# EAGLE schematic ManniRaspiRadio (EAGLE 7.3.0)

## Sheet 1 of 2
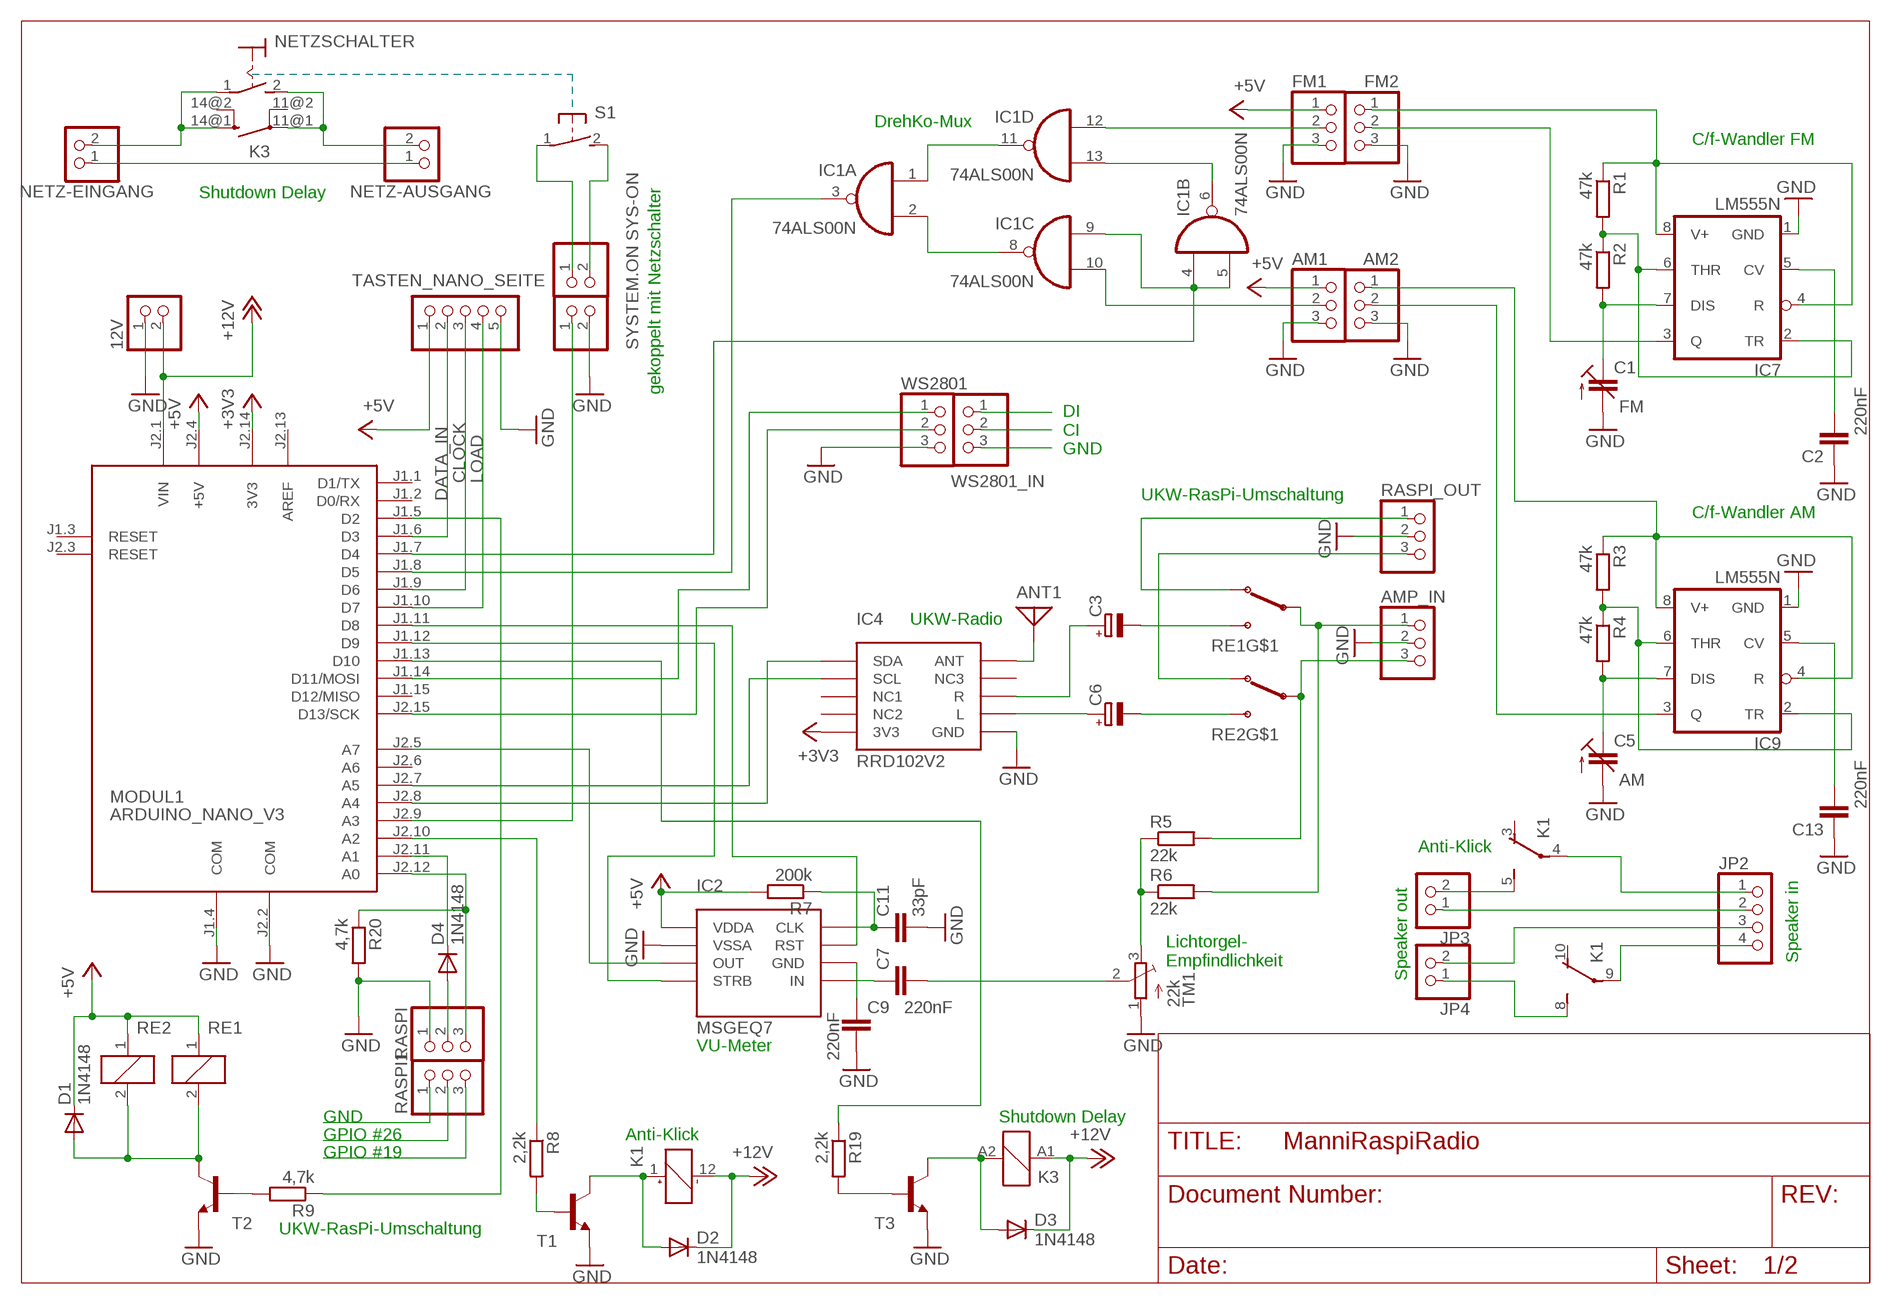
[diagram p0: schematic, sheet 1]

### Parts
12V  PINHD-1X2  [1X02]
AM1  PINHD-1X3  [1X03]
AM2  PINHD-1X3  [1X03]
AMP_IN  PINHD-1X3  [1X03]
ANT1  ANTENNA  [PAD-01]
C1  FM  C-TRIMM3018_12  [CTRIM3018_12]
C2  220nF  C-EU025-030X050  [C025-030X050]
C3  CPOL-EU139CLL-2W  [139CLL-2W]
C5  AM  C-TRIMM3018_12  [CTRIM3018_12]
C6  CPOL-EU139CLL-2W  [139CLL-2W]
C7  220nF  C-EU025-030X050  [C025-030X050]
C9  220nF  C-EU025-030X050  [C025-030X050]
C11  33pF  C-EU025-030X050  [C025-030X050]
C13  220nF  C-EU025-030X050  [C025-030X050]
D1  1N4148  1N4148DO35-10  [DO35-10]
D2  1N4148  1N4148DO35-10  [DO35-10]
D3  1N4148  1N4148DO35-10  [DO35-10]
D4  1N4148  1N4148DO35-10  [DO35-10]
FM1  PINHD-1X3  [1X03]
FM2  PINHD-1X3  [1X03]
IC1  74ALS00N  [DIL14]
IC2  MSGEQ7  [MSGEQ7]
IC4  RRD102V2  [RRD102V2]
IC7  LM555N  [DIL08]
IC9  LM555N  [DIL08]
JP2  PINHD-1X4  [1X04]
JP3  PINHD-1X2  [1X02]
JP4  PINHD-1X2  [1X02]
K1  TXD2-12V  [TXD2]
K3  FINDER-43.61  [FINDER-43.61]
MODUL1  ARDUINO_NANO_V3  ARDUINO_NANO2  [ARDUINO_NANO2]
NETZ-AUSGANG  PINHD-1X2  [1X02]
NETZ-EINGANG  PINHD-1X2  [1X02]
NETZSCHALTER  MS243  [MS243]
R1  47k  R-EU_0207/10  [0207/10]
R2  47k  R-EU_0207/10  [0207/10]
R3  47k  R-EU_0207/10  [0207/10]
R4  47k  R-EU_0207/10  [0207/10]
R5  22k  R-EU_0207/10  [0207/10]
R6  22k  R-EU_0207/10  [0207/10]
R7  200k  R-EU_0207/10  [0207/10]
R8  2,2k  R-EU_0207/10  [0207/10]
R9  4,7k  R-EU_0207/10  [0207/10]
R19  2,2k  R-EU_0207/10  [0207/10]
R20  4,7k  R-EU_0207/10  [0207/10]
RASPI  PINHD-1X3  [1X03]
RASPI1  PINHD-1X3  [1X03]
RASPI_OUT  PINHD-1X3  [1X03]
RE1  RE-SPDT--G5LE  [EPP-RELAY-G5LE]
RE2  RE-SPDT--G5LE  [EPP-RELAY-G5LE]
S1  31-XX  [B3F-31XX]
SYS-ON  PINHD-1X2  [1X02]
SYSTEM.ON  PINHD-1X2  [1X02]
T1  T-NPN-BC337-  [EPP-TO-92]
T2  T-NPN-BC337-  [EPP-TO-92]
T3  T-NPN-BC337-  [EPP-TO-92]
TASTEN_NANO_SEITE  PINHD-1X5  [1X05]
TM1  22k  TRIMPOT3386  [TRIM-3386]
WS2801  PINHD-1X3  [1X03]
WS2801_IN  PINHD-1X3  [1X03]

### Nets
+3V3: IC4.P$5(3V3) MODUL1.J2.14(3V3)
+5V: AM1.1 D1.C FM1.1 IC2.P$1(VDDA) MODUL1.J2.4(+5V) R7.2 RE1.1 RE2.1 TASTEN_NANO_SEITE.1
+12V: 12V.2 D2.C D3.C K1.12(_:-) K3.A1 MODUL1.J2.1(VIN)
CLOCK: MODUL1.J1.9(D6) TASTEN_NANO_SEITE.3
DATA_IN: MODUL1.J1.6(D3) TASTEN_NANO_SEITE.2
GND: 12V.1 AM1.3 AM2.3 AMP_IN.2 C1.-(A) C2.1 C5.-(A) C9.2 C11.2 C13.1 FM1.3 FM2.3 IC2.P$2(VSSA) IC4.P$6(GND) IC7.1(GND) IC9.1(GND) MODUL1.J1.4(COM) MODUL1.J2.2(COM) R20.2 RASPI.1 RASPI_OUT.2 SYSTEM.ON.2 T1.3(E) T2.3(E) T3.3(E) TASTEN_NANO_SEITE.5 TM1.1(A) WS2801.3 ; also sheet 2
LOAD: MODUL1.J1.10(D7) TASTEN_NANO_SEITE.4
N$1: C3.+ IC4.P$8(R)
N$2: C6.+ IC4.P$7(L)
N$3: IC4.P$1(SDA) MODUL1.J2.8(A4)
N$4: D1.A RE1.2 RE2.2 T2.1(C)
N$5: IC4.P$2(SCL) MODUL1.J2.7(A5)
N$6: ANT1.1 IC4.P$10(ANT)
N$7: JP3.2 K1.5(S)
N$8: AMP_IN.1 R6.2 RE1.P
N$9: AMP_IN.3 R5.2 RE2.P
N$10: RASPI_OUT.3 RE2.O
N$11: RASPI_OUT.1 RE1.O
N$12: C1.+(E) IC7.7(DIS) R2.2
N$13: IC7.2(TR) IC7.6(THR) R1.2 R2.1
N$14: AM2.1 IC9.4(R) IC9.8(V+) R3.1
N$15: FM2.1 IC7.4(R) IC7.8(V+) R1.1
N$16: FM2.2 IC7.3(Q)
N$17: C2.2 IC7.5(CV)
N$18: AM2.2 IC9.3(Q)
N$19: C5.+(E) IC9.7(DIS) R4.2
N$20: IC9.2(TR) IC9.6(THR) R3.2 R4.1
N$21: R5.1 R6.1 TM1.3(E)
N$22: IC1.1(A:I0) IC1.11(D:O)
N$23: C3.- RE1.S
N$24: C6.- RE2.S
N$25: IC1.2(A:I1) IC1.8(C:O)
N$26: IC1.6(B:O) IC1.13(D:I1)
N$27: IC1.4(B:I0) IC1.5(B:I1) IC1.9(C:I0) MODUL1.J1.7(D4)
N$28: C13.2 IC9.5(CV)
N$29: R8.2 T1.2(B)
N$30: IC1.3(A:O) MODUL1.J1.8(D5)
N$31: IC2.P$3(OUT) MODUL1.J2.5(A7)
N$32: IC2.P$4(STRB) MODUL1.J1.12(D9)
N$33: C7.2 TM1.2(S)
N$34: C9.1 IC2.P$6(GND)
N$35: MODUL1.J2.10(A2) R8.1
N$36: C7.1 IC2.P$5(IN)
N$37: D2.A K1.1(_:+) T1.1(C)
N$38: C11.1 IC2.P$8(CLK) R7.1
N$39: IC2.P$7(RST) MODUL1.J1.11(D8)
N$40: MODUL1.J1.14(D11/MOSI) WS2801.1
N$41: MODUL1.J2.15(D13/SCK) WS2801.2
N$42: AM1.2 IC1.10(C:I1)
N$43: FM1.2 IC1.12(D:I0)
N$44: JP4.1 K1.8(S)
N$46: JP2.1 K1.4(P)
N$49: R9.2 T2.2(B)
N$50: MODUL1.J1.5(D2) R9.1
N$57: JP2.2 JP3.1
N$58: JP2.3 JP4.2
N$59: JP2.4 K1.9(P)
N$63: R19.2 T3.2(B)
N$64: D3.A K3.A2 T3.1(C)
N$66: MODUL1.J1.13(D10) R19.1
N$67: K3.14@1(-1:SA) NETZ-EINGANG.2 NETZSCHALTER.1(P)
N$68: K3.11@1(-1:PA) NETZ-AUSGANG.2 NETZSCHALTER.2(S)
N$69: NETZ-AUSGANG.1 NETZ-EINGANG.1
N$70: D4.C MODUL1.J2.11(A1)
N$71: D4.A RASPI.2
N$72: MODUL1.J2.12(A0) R20.1 RASPI.3
N$73: MODUL1.J2.9(A3) SYSTEM.ON.1
N$74: RASPI1.1
N$75: RASPI1.2
N$76: RASPI1.3
N$77: WS2801_IN.1
N$78: WS2801_IN.2
N$79: WS2801_IN.3
N$80: S1.1(P) SYS-ON.1
N$81: S1.2(S) SYS-ON.2
Unconnected: IC4.P$3(NC1) IC4.P$4(NC2) IC4.P$9(NC3) K1.3(O) K1.10(O) K3.11@2(-1:PB) K3.14@2(-1:SB) MODUL1.J1.1(D1/TX) MODUL1.J1.2(D0/RX) MODUL1.J1.3(RESET) MODUL1.J1.15(D12/MISO) MODUL1.J2.3(RESET) MODUL1.J2.6(A6)

### Notes on the sheet
- DrehKo-Mux
- C/f-Wandler FM
- Shutdown Delay
- gekoppelt mit Netzschalter
- DI
  CI
  GND
- UKW-RasPi-Umschaltung
- C/f-Wandler AM
- UKW-Radio
- Anti-Klick
- Speaker in
- Lichtorgel-
  Empfindlichkeit
- Speaker out
- VU-Meter
- GND | Shutdown Delay
- GPIO #26 | Anti-Klick
- GPIO #19
- UKW-RasPi-Umschaltung

## Sheet 2 of 2
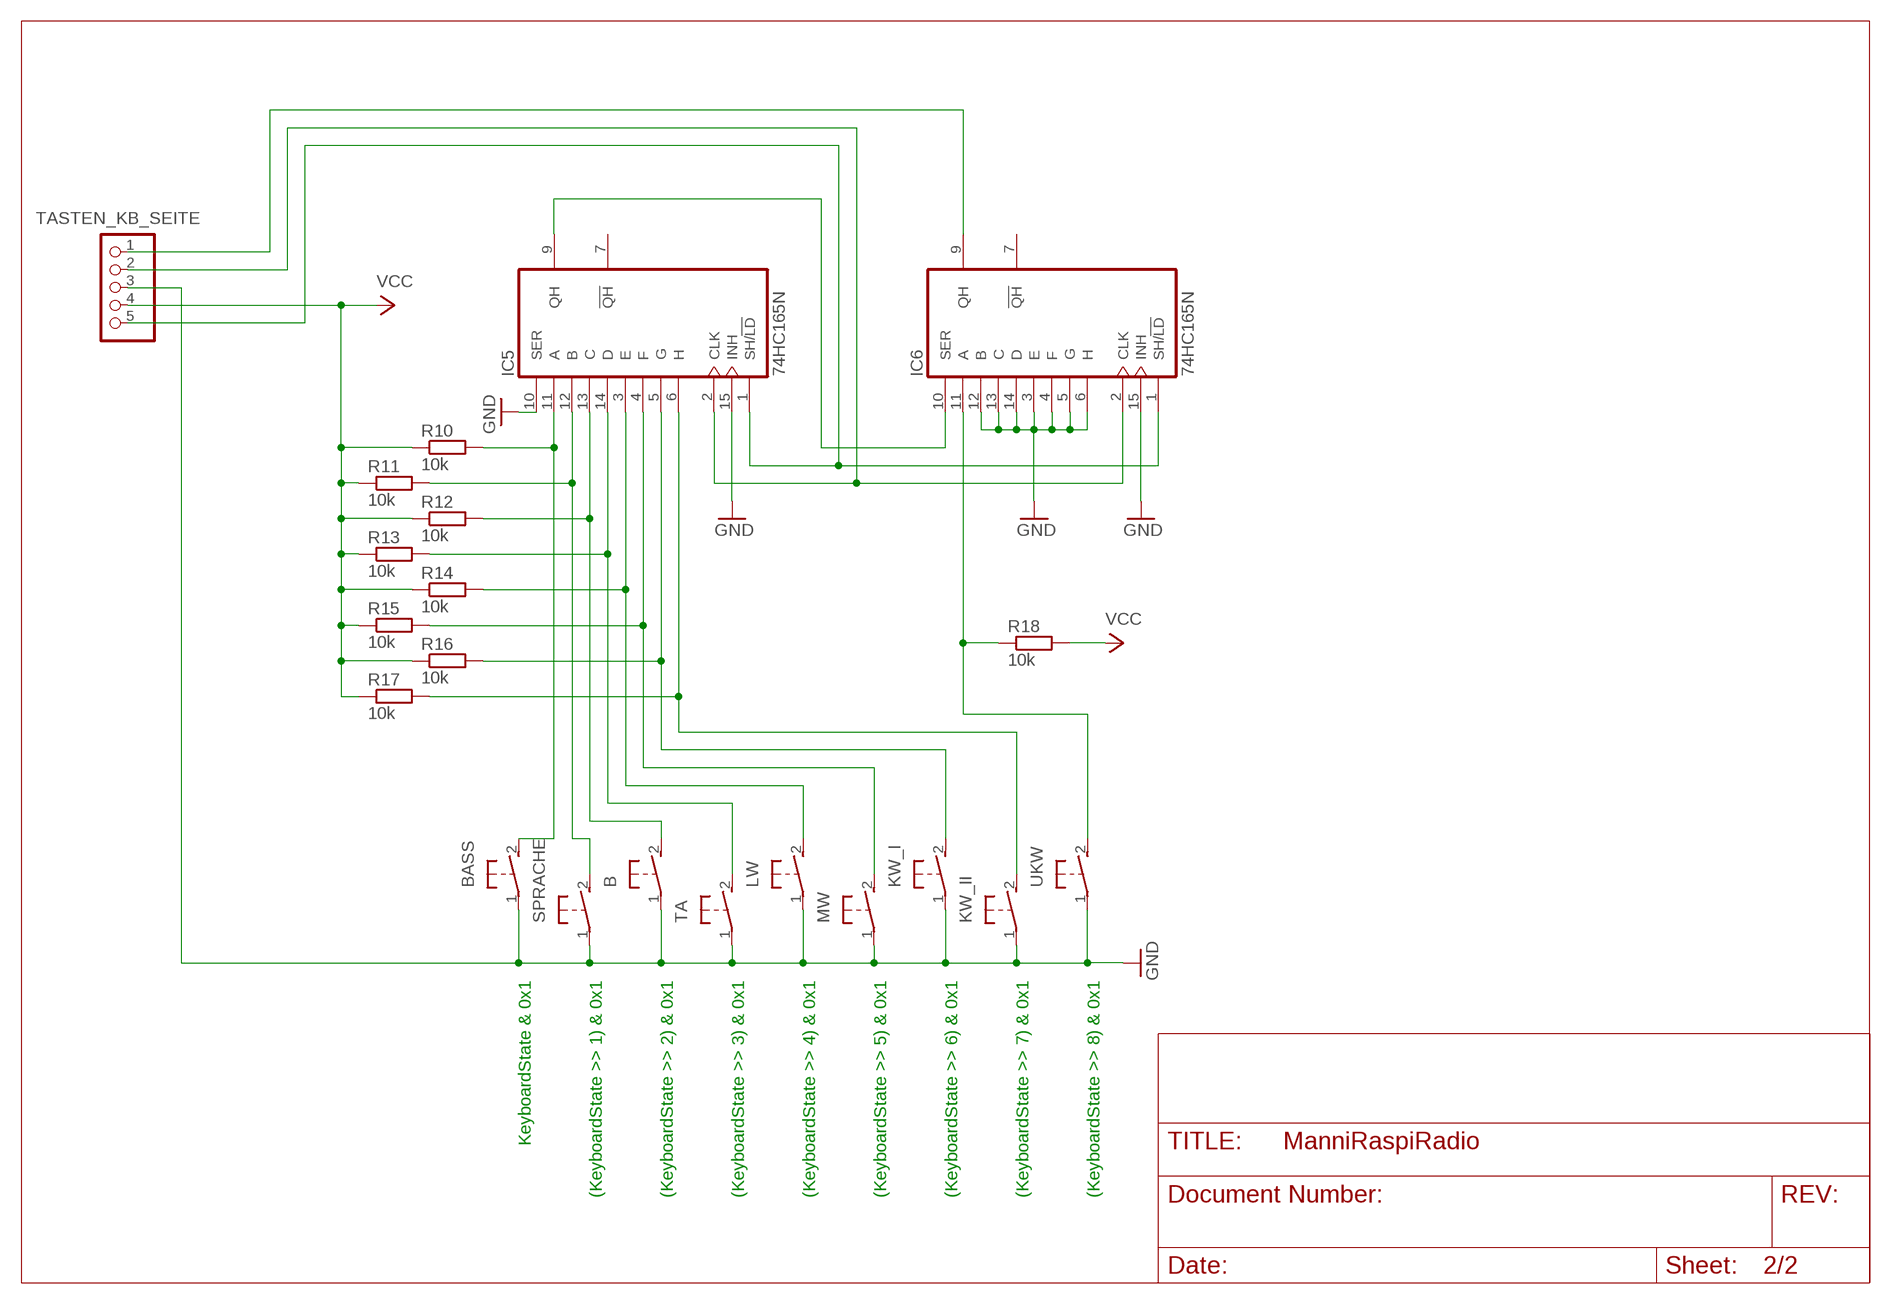
[diagram p1: schematic, sheet 2]

### Parts
B  31-XX  [B3F-31XX]
BASS  31-XX  [B3F-31XX]
IC5  74HC165N  [DIL16]
IC6  74HC165N  [DIL16]
KW_I  31-XX  [B3F-31XX]
KW_II  31-XX  [B3F-31XX]
LW  31-XX  [B3F-31XX]
MW  31-XX  [B3F-31XX]
R10  10k  R-EU_0207/10  [0207/10]
R11  10k  R-EU_0207/10  [0207/10]
R12  10k  R-EU_0207/10  [0207/10]
R13  10k  R-EU_0207/10  [0207/10]
R14  10k  R-EU_0207/10  [0207/10]
R15  10k  R-EU_0207/10  [0207/10]
R16  10k  R-EU_0207/10  [0207/10]
R17  10k  R-EU_0207/10  [0207/10]
R18  10k  R-EU_0207/10  [0207/10]
SPRACHE  31-XX  [B3F-31XX]
TA  31-XX  [B3F-31XX]
TASTEN_KB_SEITE  PINHD-1X5  [1X05]
UKW  31-XX  [B3F-31XX]

### Nets
GND: B.1(P) BASS.1(P) IC5.10(SER) IC5.15(INH) IC6.3(E) IC6.4(F) IC6.5(G) IC6.6(H) IC6.12(B) IC6.13(C) IC6.14(D) IC6.15(INH) KW_I.1(P) KW_II.1(P) LW.1(P) MW.1(P) SPRACHE.1(P) TA.1(P) TASTEN_KB_SEITE.3 UKW.1(P) ; also sheet 1
N$45: BASS.2(S) IC5.11(A) R10.2
N$47: IC5.12(B) R11.2 SPRACHE.2(S)
N$48: B.2(S) IC5.13(C) R12.2
N$51: IC5.14(D) R13.2 TA.2(S)
N$52: IC5.3(E) LW.2(S) R14.2
N$53: IC5.4(F) MW.2(S) R15.2
N$54: IC5.5(G) KW_I.2(S) R16.2
N$55: IC5.6(H) KW_II.2(S) R17.2
N$56: IC6.11(A) R18.1 UKW.2(S)
N$60: IC5.9(QH) IC6.10(SER)
N$61: IC5.2(CLK) IC6.2(CLK) TASTEN_KB_SEITE.2
N$62: IC5.1(SH/!LD) IC6.1(SH/!LD) TASTEN_KB_SEITE.5
N$65: IC6.9(QH) TASTEN_KB_SEITE.1
VCC: R10.1 R11.1 R12.1 R13.1 R14.1 R15.1 R16.1 R17.1 R18.2 TASTEN_KB_SEITE.4
Unconnected: IC5.7(!QH) IC6.7(!QH)

### Notes on the sheet
- KeyboardState & 0x1 | (KeyboardState >> 1) & 0x1 | (KeyboardState >> 2) & 0x1 | (KeyboardState >> 3) & 0x1 | (KeyboardState >> 4) & 0x1 | (KeyboardState >> 5) & 0x1 | (KeyboardState >> 6) & 0x1 | (KeyboardState >> 7) & 0x1 | (KeyboardState >> 8) & 0x1

## Power pins joined to a net without a drawn wire
AREF: MODUL1.J2.13(AREF)
GND: IC1.7(P:GND) IC5.8(GND) IC6.8(GND)
VCC: IC1.14(P:VCC) IC5.16(VCC) IC6.16(VCC)

## Library data of the parts
12V JP3 JP4 NETZ-AUSGANG NETZ-EINGANG SYS-ON SYSTEM.ON = pinhead:PINHD-1X2: PIN HEADER
AM1 AM2 AMP_IN FM1 FM2 RASPI RASPI1 RASPI_OUT WS2801 WS2801_IN = pinhead:PINHD-1X3: PIN HEADER
ANT1 = discrete:ANTENNA: Antenna
B BASS KW_I KW_II LW MW S1 SPRACHE TA UKW = adafruit:31-XX: OMRON SWITCH Now with beefier pads!
C1 C5 = rcl:C-TRIMM: Trimm capacitor
C2 C7 C9 C11 C13 = rcl:C-EU: CAPACITOR, European symbol
C3 C6 = rcl:CPOL-EU: POLARIZED CAPACITOR, European symbol
D1-D4 = diode:1N4148: DIODE high speed (Philips)
IC1 = 74xx-eu:74*00: Quad 2-input NAND gate
IC2 = MSQEQ7:MSGEQ7
IC4 = RRD102V2:RRD102V2
IC5 IC6 = 74xx-eu:74*165: 8-bit parallel load SHIFT REGISTER
IC7 IC9 = linear:*555: TIMER
JP2 = pinhead:PINHD-1X4: PIN HEADER
K1 = relay:TX?-*: TX Relais NAiS TX-D RELAYS HIGH INSULATION Conforming to the supplementary insulation class of EN Standards (EN41003) Source: http://www.mew-europe.com/.. en_ds_61022_0007.pdf TX-S RELAYS SMALL POLARIZED RELAY WITH HIGH SENSITIVITY 50mW Source: http://www.mew-europe.com/.. en_ds_61022_0022.pdf
K3 = relay:FINDER-43.61: Low profile PCB relays 10 - 16 A FINDER 43 Series Kontakt max. AC- 250V, Strom - Kontakt AC- max. 10A 5 mm contact pin pitch, 1 Pole NO, 16 A, PCB mount Distributor: FARNELL Source: http://www.farnell.com/datasheets/87682.pdf
MODUL1 = arduino-nano:ARDUINO_NANO2: Arduino Nano2 Auto generated by modulcreator.ulp \;; ANZAHL: 2; MODUL: TRUE; STECKX0: -76200; STECKX1: 76200; STECKY0: 177800; STECKY1: 177800
NETZSCHALTER = switch:MS243: TOGGLE SWITCH
R1-R20 = rcl:R-EU_: RESISTOR, European symbol
RE1 RE2 = elpp-v0.0:RE-SPDT-*-: Relay, SPDT; FARNELL: 9949887; RS: 369466
T1-T3 = elpp-v0.0:T-NPN-*-: Transistor, bipolar junction (BJT), NPN; FARNELL: 1228215; RS: 6254966
TASTEN_KB_SEITE TASTEN_NANO_SEITE = pinhead:PINHD-1X5: PIN HEADER
TM1 = adafruit:TRIMPOT: SMT trimmer potentiometer part number TC33X http://www.ladyada.net/library/eagle